# Altium schematic sheet pri_multifn.SchDoc
size A3
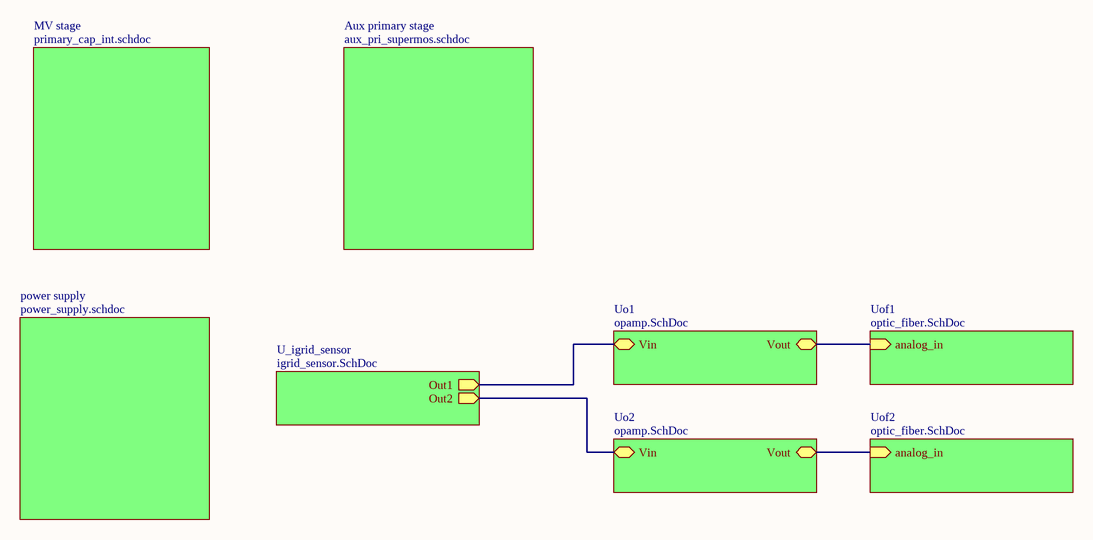
[diagram p0: pri_multifn.SchDoc]

## Sub-sheets
Aux primary stage = aux_pri_supermos.schdoc: no entries
MV stage = primary_cap_int.schdoc: no entries
power supply = power_supply.schdoc: no entries
U_igrid_sensor = igrid_sensor.SchDoc: Out1 (out), Out2 (out)
Uo1 = opamp.SchDoc: Vin (bidir), Vout (bidir)
Uo2 = opamp.SchDoc: Vin (bidir), Vout (bidir)
Uof1 = optic_fiber.SchDoc: analog_in (in)
Uof2 = optic_fiber.SchDoc: analog_in (in)

## Nets
(unnamed): sheet U_igrid_sensor/Out1, sheet Uo1/Vin
(unnamed): sheet U_igrid_sensor/Out2, sheet Uo2/Vin
(unnamed): sheet Uo1/Vout, sheet Uof1/analog_in
(unnamed): sheet Uo2/Vout, sheet Uof2/analog_in